# EAGLE design A3901 (EAGLE 7.1.0)
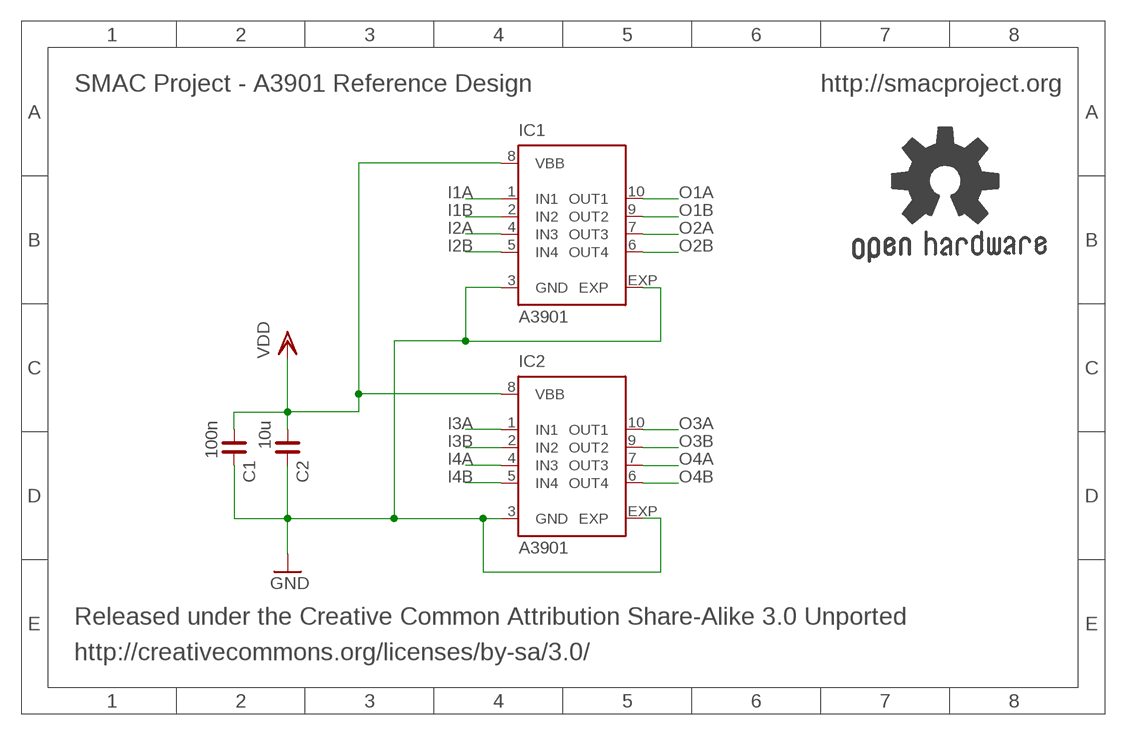
[diagram p0: schematic, sheet 1]

## Parts
C1  100n  C_0402  [C0402]
C2  10u  C_0402  [C0402]
GOLD_ORB_SM1  OSHWLOGO_REF_SM  [OSHW2REF]
IC1  A3901  [DFN10-3X3]
IC2  A3901  [DFN10-3X3]

## Nets
GND: C1.2 C2.2 IC1.3(GND) IC1.EXP IC2.3(GND) IC2.EXP
I1A: IC1.1(IN1)
I1B: IC1.2(IN2)
I2A: IC1.4(IN3)
I2B: IC1.5(IN4)
I3A: IC2.1(IN1)
I3B: IC2.2(IN2)
I4A: IC2.4(IN3)
I4B: IC2.5(IN4)
O1A: IC1.10(OUT1)
O1B: IC1.9(OUT2)
O2A: IC1.7(OUT3)
O2B: IC1.6(OUT4)
O3A: IC2.10(OUT1)
O3B: IC2.9(OUT2)
O4A: IC2.7(OUT3)
O4B: IC2.6(OUT4)
VDD: C1.1 C2.1 IC1.8(VBB) IC2.8(VBB)

## Notes on the sheet
- SMAC Project - A3901 Reference Design | http://smacproject.org
- Released under the Creative Common Attribution Share-Alike 3.0 Unported
- http://creativecommons.org/licenses/by-sa/3.0/

## Library data of the parts
C1 C2 = rc-master-smd:C_: NON-POLARIZED CAP
GOLD_ORB_SM1 = bfl:OSHWLOGO: These are Open-Source Hardware logos.
IC1 IC2 = Allegro:A3901: Dual Full Bridge Low Voltage Motor Driver Source: www.allegromicro.com .. 3901.pdf; MPN: A3901SEJTR-T; OC_FARNELL: 1651947; OC_NEWARK: 87K3379

## Board
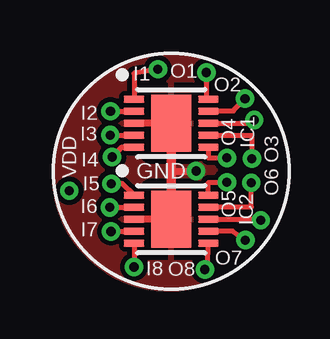
[diagram p1: board, top side]
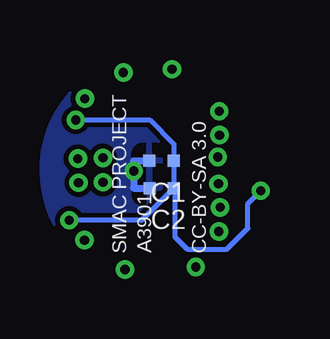
[diagram p2: board, bottom side, seen from below]

No outline drawn. Coordinates in mm, seen from the top.
Copper layers (1*16): Top 0.035mm / dielectric 1.5mm / Bottom 0.035mm
Design rules "2_layer_standard_4pcb *": minimum track width 5mil, minimum drill 15mil, track to track 6mil, track to pad 6mil, pad to pad 6mil, via to via 6mil, smd to smd 0mil, copper to edge 6mil, drill to drill 6mil, minimum pad ring 7.5mil, minimum via ring 7.5mil, stop-mask expansion 0mil, vias tented up to drill 15mil, thermal gap 20mil

### Footprints (pad centres in the part's own frame; a part is rotated, then mirrored left to right if it is on the bottom)
C0402 = smd 0.5 x 0.5: 1 -0.508,0; 2 0.508,0
DFN10-3X3 = smd 0.3 x 0.85: 1 -1,-1.55; 2 -0.5,-1.55; 3 0,-1.55; 4 0.5,-1.55; 5 1,-1.55; 6 1,1.55; 7 0.5,1.55; 8 0,1.55; 9 -0.5,1.55; 10 -1,1.55 | smd 2.38 x 1.65: EXP 0,0

### Placement (x,y rotation side)
C1  -0.12,0.43 180 bottom
C2  -0.13,-0.7 180 bottom
GOLD_ORB_SM1  6.93,-3.43 0 top
IC1  0,2 270 top
IC2  0,-2 270 top

### Tracks (layer width: path | path; a pad name or v marks a point on that pad's centre or on a via)
GND  (via drill 0.38 pad 0.76)
  Top 0.3: -0.17,2.48 -0.65,2 IC1.3 | IC2.3 IC2.EXP 0,0.01 v1.04,0.01
  Top 0.4: IC2.EXP 0,2.32 -0.17,2.48
  Bottom 0.3: C1.2 1.04,0.43 v1.04,0.01 1.04,-0.7 C2.2
  pour Bottom (isolate 0.2): -4.88,-0.03 -4.88,0.01 arc-90 0.03,4.92 arc-98 4.86,-0.59 arc-83 -0.09,-4.92 arc-91 -4.9,-0.02
  pour Top (isolate 0.2): -4.9,-0.06 -4.9,-0.02 arc-90 0.01,4.89 arc-98 4.84,-0.62 arc-83 -0.1,-4.95 arc-91 -4.91,-0.05
I1A  (via drill 0.38 pad 0.76)
  Top 0.2: v-0.56,4.25 -1.55,4.07 IC1.1
I1B  (via drill 0.38 pad 0.76)
  Top 0.2: v-2.53,2.5 IC1.2
I2A  (via drill 0.38 pad 0.76)
  Top 0.2: v-2.54,1.5 IC1.4
I2B  (via drill 0.38 pad 0.76)
  Top 0.2: IC1.5 -2.06,1 v-2.46,0.59
I3A  (via drill 0.38 pad 0.76)
  Top 0.2: IC2.1 -2.04,-0.51 v-2.49,-0.52
I3B  (via drill 0.38 pad 0.76)
  Top 0.2: v-2.56,-1.51 IC2.2
I4A  (via drill 0.38 pad 0.76)
  Top 0.2: v-2.51,-2.51 -1.55,-2.51 IC2.4
I4B  (via drill 0.38 pad 0.76)
  Top 0.2: IC2.5 | IC2.5 v-1.55,-3.99
O1A  (via drill 0.38 pad 0.76)
  Top 0.2: v1.47,4.12 1.47,3 IC1.10
O1B  (via drill 0.38 pad 0.76)
  Top 0.2: IC1.9 1.55,2.51 2.59,2.51 v3.07,3.03
O2A  (via drill 0.38 pad 0.76)
  Top 0.2: IC1.7 3.36,1.5 v3.36,0.53
O2B  (via drill 0.38 pad 0.76)
  Top 0.2: IC1.6 1.55,0.55 v2.32,0.55
O3A  (via drill 0.38 pad 0.76)
  Top 0.2: IC2.10 1.55,-0.46 v2.32,-0.46
O3B  (via drill 0.38 pad 0.76)
  Top 0.2: IC2.9 1.55,-1.49 3.34,-1.49 v3.34,-0.48
O4A  (via drill 0.38 pad 0.76)
  Top 0.2: v3.09,-2.87 2.55,-2.5 IC2.7
O4B  (via drill 0.38 pad 0.76)
  Top 0.2: IC2.6 1.52,-3.93 v1.4,-4.09
VDD  (via drill 0.38 pad 0.76)
  Top 0.2: 3.23,2 v3.46,2.13 arc-90 3.23,2 IC1.8 | IC2.8 3.68,-2 v3.73,-2.04
  Bottom 0.2: v3.73,-2.04 0.7,-2.04 C2.1 | C2.1 -0.68,-0.69 -0.68,-2.74 -1.2,-3.25 -2.85,-3.25 -3.72,-2.38 -3.72,-1.35 v-4.25,-0.82 | C2.1 C1.1 -0.63,1.12 0.38,2.13 v3.46,2.13

### Text on the board
tPlace: I1 | O1 | O2 | I2 | I3 | O4 | VDD | I4 | GND | I5 | O6 O3 | I6 | O5 | I7 | I8 | O8 | O7
bPlace: CC-BY-SA 3.0 | A3901 | SMAC PROJECT
Reference: http://smacproject.org